# Altium schematic sheet SINUX_V3_MAIN.SchDoc
size 594 x 420 mm
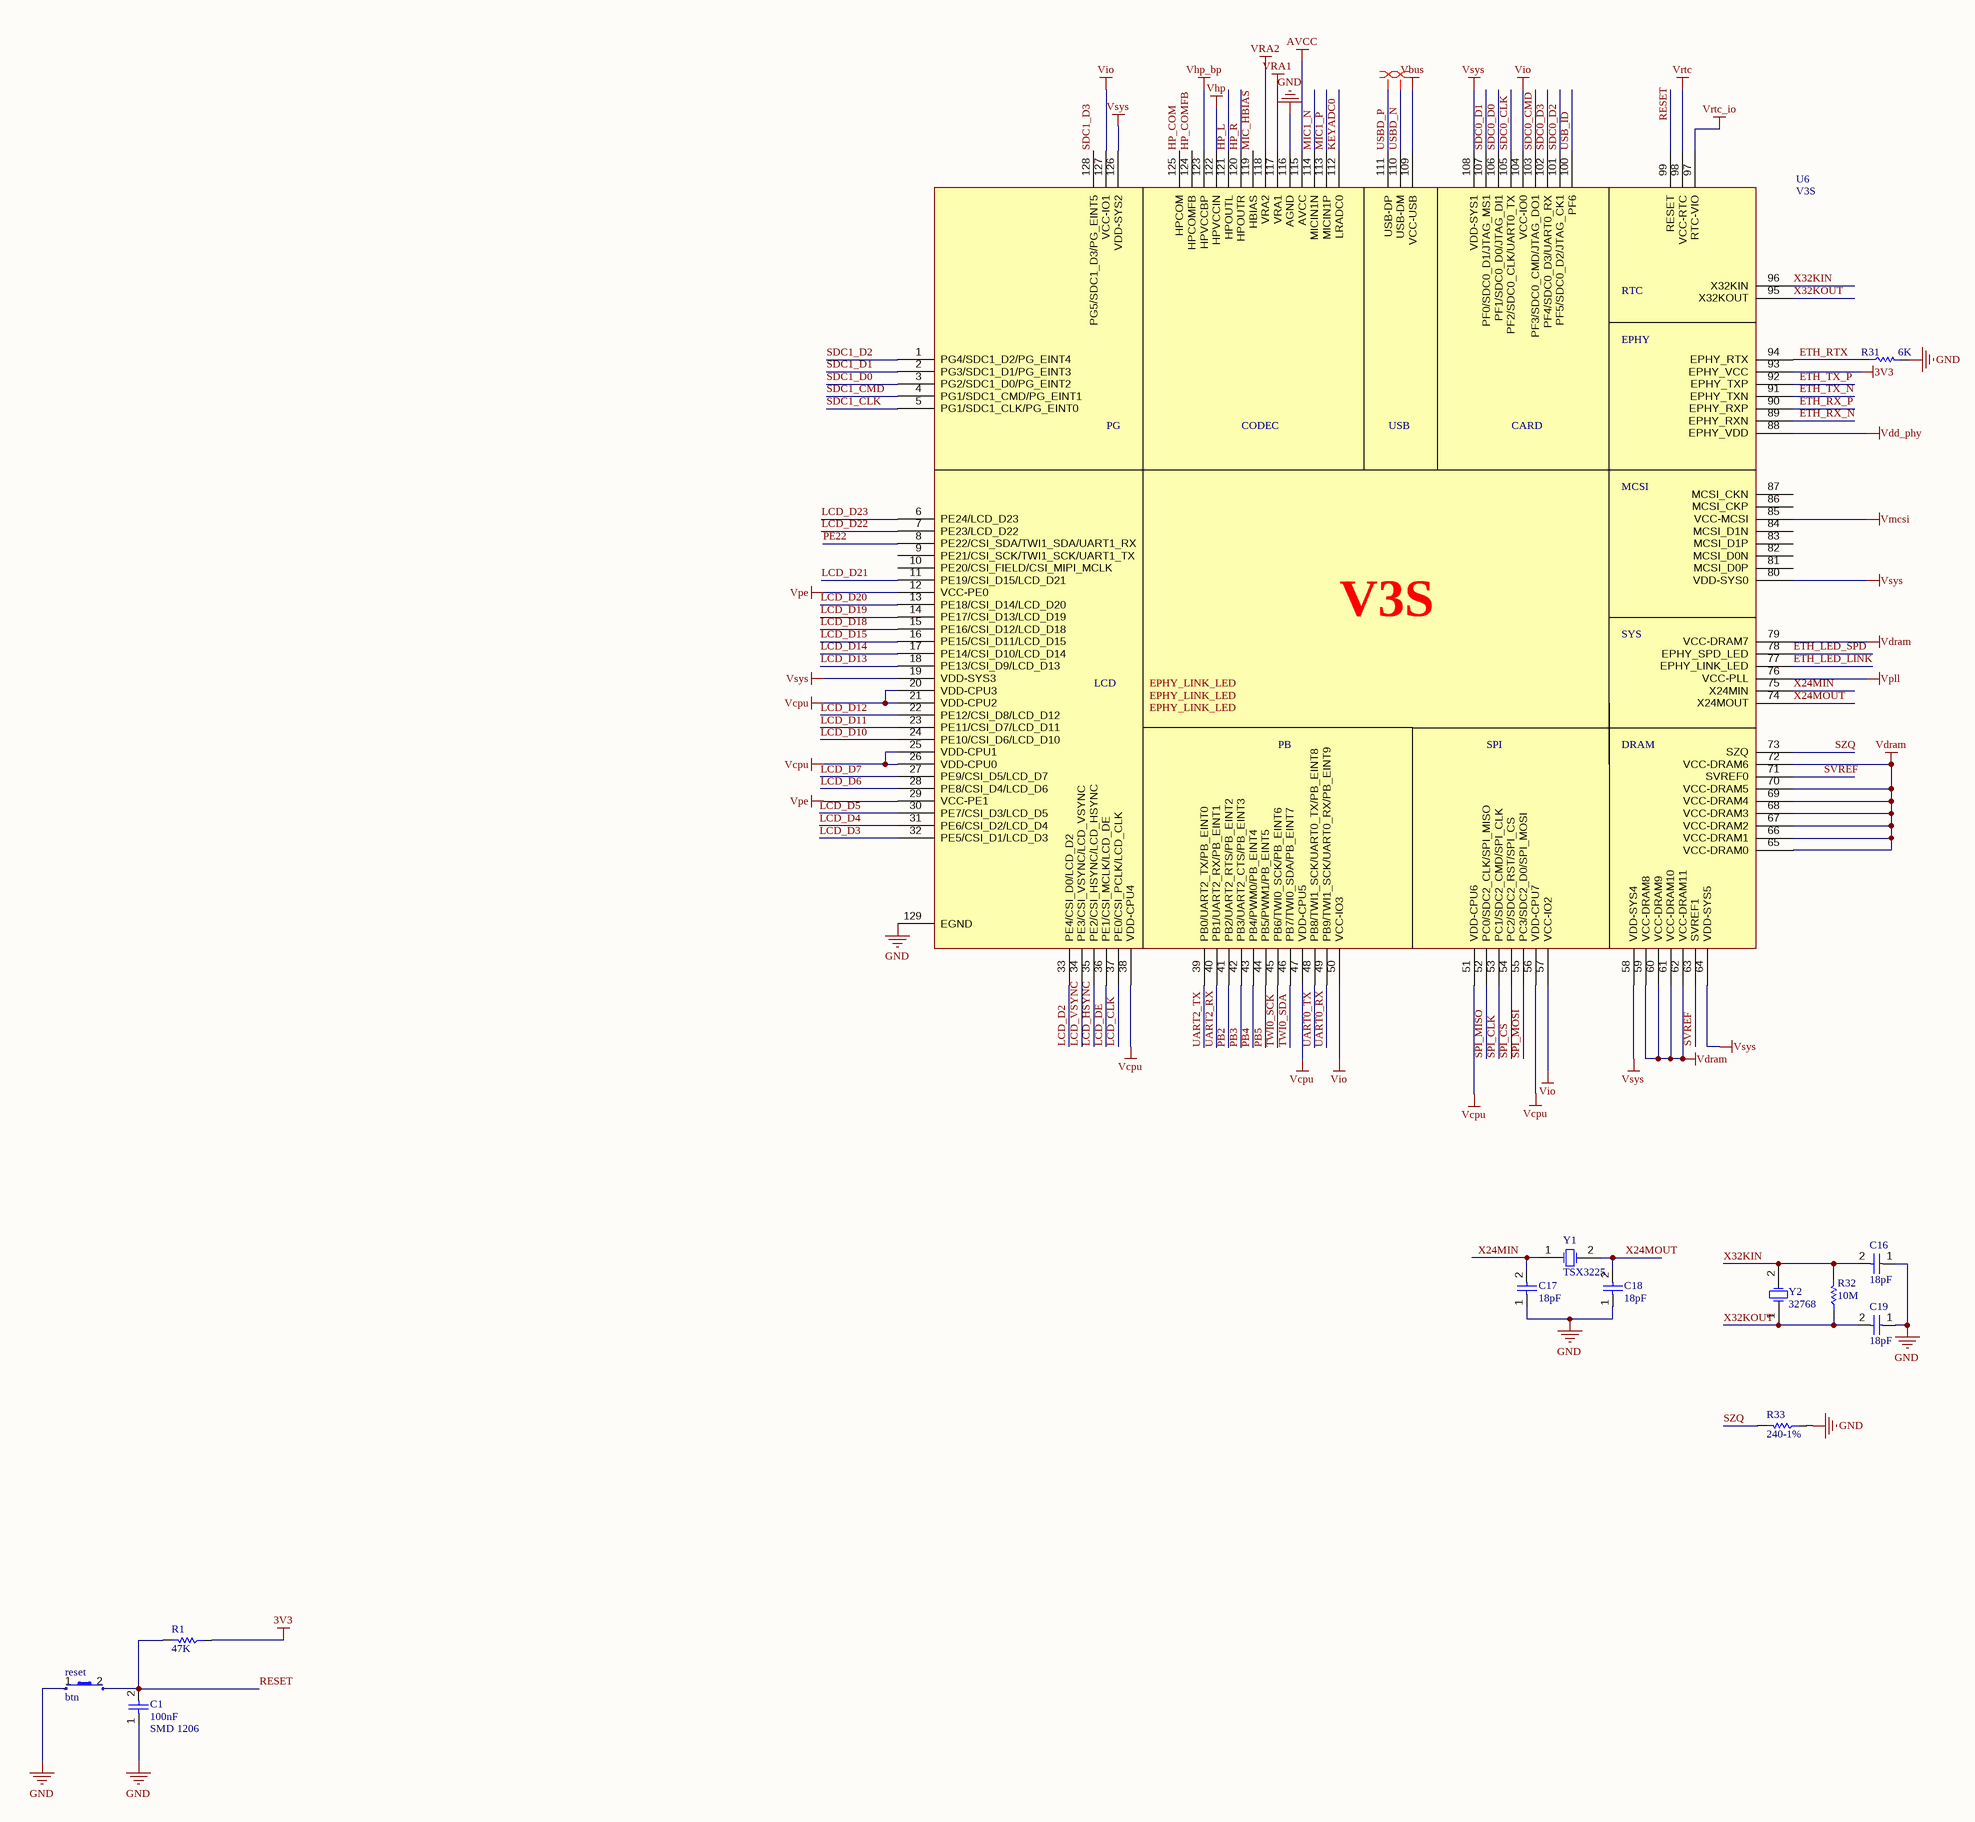
[diagram p0: SINUX_V3_MAIN.SchDoc]

## Parts
C1  100nF  [SMD 0805]
C16  18pF  [SMD 0805]
C17  18pF  [SMD 0805]
C18  18pF  [SMD 0805]
C19  18pF  [SMD 0805]
R1  47K  [0805_1/8W]
R31  6K  [0805_1/8W]
R32  10M  [0805_1/8W]
R33  240-1%  [0805_1/8W]
reset  btn  [btn]
U6  V3S  [V3S]
Y1  TSX3225  [XTAL  SMD]
Y2  32768  [XTAL RTC]

## Nets
3V3: R1.1 U6.93(EPHY_VCC)
AVCC: U6.115(AVCC)
GND: C1.1 C16.1 C17.1 C18.1 C19.1 R31.2 R33.1 reset.1 U6.116(AGND) U6.129(EGND)
Vbus: U6.109(VCC-USB)
Vcpu: U6.20(VDD-CPU3) U6.21(VDD-CPU2) U6.25(VDD-CPU1) U6.26(VDD-CPU0) U6.38(VDD-CPU4) U6.47(VDD-CPU5) U6.51(VDD-CPU6) U6.56(VDD-CPU7)
Vdd_phy: U6.88(EPHY_VDD)
Vdram: U6.59(VCC-DRAM8) U6.60(VCC-DRAM9) U6.61(VCC-DRAM10) U6.62(VCC-DRAM11) U6.65(VCC-DRAM0) U6.66(VCC-DRAM1) U6.67(VCC-DRAM2) U6.68(VCC-DRAM3) U6.69(VCC-DRAM4) U6.70(VCC-DRAM5) U6.72(VCC-DRAM6) U6.79(VCC-DRAM7)
Vhp: U6.122(HPVCCIN)
Vhp_bp: U6.123(HPVCCBP)
Vio: U6.50(VCC-IO3) U6.57(VCC-IO2) U6.104(VCC-IO0) U6.127(VCC-IO1)
Vmcsi: U6.85(VCC-MCSI)
Vpe: U6.12(VCC-PE0) U6.29(VCC-PE1)
Vpll: U6.76(VCC-PLL)
VRA1: U6.117(VRA1)
VRA2: U6.118(VRA2)
Vrtc: U6.98(VCC-RTC)
Vrtc_io: U6.97(RTC-VIO)
Vsys: U6.19(VDD-SYS3) U6.58(VDD-SYS4) U6.64(VDD-SYS5) U6.80(VDD-SYS0) U6.108(VDD-SYS1) U6.126(VDD-SYS2)
ETH_LED_LINK: U6.77(EPHY_LINK_LED)
ETH_LED_SPD: U6.78(EPHY_SPD_LED)
ETH_RTX: R31.1 U6.94(EPHY_RTX)
ETH_RX_N: U6.89(EPHY_RXN)
ETH_RX_P: U6.90(EPHY_RXP)
ETH_TX_N: U6.91(EPHY_TXN)
ETH_TX_P: U6.92(EPHY_TXP)
HP_COM: U6.125(HPCOM)
HP_COMFB: U6.124(HPCOMFB)
HP_L: U6.121(HPOUTL)
HP_R: U6.120(HPOUTR)
KEYADC0: U6.112(LRADC0)
LCD_CLK: U6.37(PE0/CSI_PCLK/LCD_CLK)
LCD_D2: U6.33(PE4/CSI_D0/LCD_D2)
LCD_D3: U6.32(PE5/CSI_D1/LCD_D3)
LCD_D4: U6.31(PE6/CSI_D2/LCD_D4)
LCD_D5: U6.30(PE7/CSI_D3/LCD_D5)
LCD_D6: U6.28(PE8/CSI_D4/LCD_D6)
LCD_D7: U6.27(PE9/CSI_D5/LCD_D7)
LCD_D10: U6.24(PE10/CSI_D6/LCD_D10)
LCD_D11: U6.23(PE11/CSI_D7/LCD_D11)
LCD_D12: U6.22(PE12/CSI_D8/LCD_D12)
LCD_D13: U6.18(PE13/CSI_D9/LCD_D13)
LCD_D14: U6.17(PE14/CSI_D10/LCD_D14)
LCD_D15: U6.16(PE15/CSI_D11/LCD_D15)
LCD_D18: U6.15(PE16/CSI_D12/LCD_D18)
LCD_D19: U6.14(PE17/CSI_D13/LCD_D19)
LCD_D20: U6.13(PE18/CSI_D14/LCD_D20)
LCD_D21: U6.11(PE19/CSI_D15/LCD_D21)
LCD_D22: U6.7(PE23/LCD_D22)
LCD_D23: U6.6(PE24/LCD_D23)
LCD_DE: U6.36(PE1/CSI_MCLK/LCD_DE)
LCD_HSYNC: U6.35(PE2/CSI_HSYNC/LCD_HSYNC)
LCD_VSYNC: U6.34(PE3/CSI_VSYNC/LCD_VSYNC)
MIC1_N: U6.114(MICIN1N)
MIC1_P: U6.113(MICIN1P)
MIC_HBIAS: U6.119(HBIAS)
PB2: U6.41(PB2/UART2_RTS/PB_EINT2)
PB3: U6.42(PB3/UART2_CTS/PB_EINT3)
PB4: U6.43(PB4/PWM0/PB_EINT4)
PB5: U6.44(PB5/PWM1/PB_EINT5)
PE22: U6.8(PE22/CSI_SDA/TWI1_SDA/UART1_RX)
RESET: C1.2 R1.2 reset.2 U6.99(RESET)
SDC0_CLK: U6.105(PF2/SDC0_CLK/UART0_TX)
SDC0_CMD: U6.103(PF3/SDC0_CMD/JTAG_DO1)
SDC0_D0: U6.106(PF1/SDC0_D0/JTAG_DI1)
SDC0_D1: U6.107(PF0/SDC0_D1/JTAG_MS1)
SDC0_D2: U6.101(PF5/SDC0_D2/JTAG_CK1)
SDC0_D3: U6.102(PF4/SDC0_D3/UART0_RX)
SDC1_CLK: U6.5(PG1/SDC1_CLK/PG_EINT0)
SDC1_CMD: U6.4(PG1/SDC1_CMD/PG_EINT1)
SDC1_D0: U6.3(PG2/SDC1_D0/PG_EINT2)
SDC1_D1: U6.2(PG3/SDC1_D1/PG_EINT3)
SDC1_D2: U6.1(PG4/SDC1_D2/PG_EINT4)
SDC1_D3: U6.128(PG5/SDC1_D3/PG_EINT5)
SPI_CLK: U6.53(PC1/SDC2_CMD/SPI_CLK)
SPI_CS: U6.54(PC2/SDC2_RST/SPI_CS)
SPI_MISO: U6.52(PC0/SDC2_CLK/SPI_MISO)
SPI_MOSI: U6.55(PC3/SDC2_D0/SPI_MOSI)
SVREF: U6.63(SVREF1) U6.71(SVREF0)
SZQ: R33.2 U6.73(SZQ)
TWI0_SCK: U6.45(PB6/TWI0_SCK/PB_EINT6)
TWI0_SDA: U6.46(PB7/TWI0_SDA/PB_EINT7)
UART0_RX: U6.49(PB9/TWI1_SCK/UART0_RX/PB_EINT9)
UART0_TX: U6.48(PB8/TWI1_SCK/UART0_TX/PB_EINT8)
UART2_RX: U6.40(PB1/UART2_RX/PB_EINT1)
UART2_TX: U6.39(PB0/UART2_TX/PB_EINT0)
USB_ID: U6.100(PF6)
USBD_N: U6.110(USB-DM)
USBD_P: U6.111(USB-DP)
X24MIN: C17.2 U6.75(X24MIN) Y1.1(OSC1)
X24MOUT: C18.2 U6.74(X24MOUT) Y1.2(OSC2)
X32KIN: C16.2 R32.2 U6.96(X32KIN) Y2.2(OSC2)
X32KOUT: C19.2 R32.1 U6.95(X32KOUT) Y2.1(OSC1)

Not connected (* = marked no-connect by the designer): U6 9(PE21/CSI_SCK/TWI1_SCK/UART1_TX) 10(PE20/CSI_FIELD/CSI_MIPI_MCLK) 81(MCSI_D0P) 82(MCSI_D0N) 83(MCSI_D1P) 84(MCSI_D1N) 86(MCSI_CKP) 87(MCSI_CKN)

## Layout directives
differential pair: USBD_N, USBD_P

## Notes on the sheet
- Labels drawn without touching a wire or pin: EPHY_LINK_LED
- DWG NO:
- REV:
- THIS DOCUMENT AND THE DATA DISCLOSED HEREIN OR
- HEREWITH IS THE PROPERTY OF ALTIUM LIMITED AND MAY
- BE FREELY DISTRIBUTED IN WHOLE. NO RIGHTS ARE
- RESERVED OR EXPRESS OR IMPLIED WARANTEE GIVEN.
- REVISION
- DESCRIPTION
- DATE
- APPROVED
- ENG:
- APPROVALS
- PROJECT
- DSN:
- CHK:
- REFERENCE DOCUMENTS
- PROJECT REVISION:
- TITLE
- DOCUMENT REVISION:
- DESIGN ITEM:
- BOM:
- FAB DWG:
- PCB DWG:
- ASSY DWG:
- SCALE:
- A2
- SIZE
- CAGE CODE
- FILE NAME
- DWG NO.
- SHEET
- OF
- REV
- (in symbol CAP NON) SMD 1206
- (in symbol V3S) RTC; EPHY; PG; CODEC; USB; CARD; MCSI; SYS; LCD; PB; SPI; DRAM

## Library data of the parts
C1 C16-C19 = CAP NON
R1 R31-R33 = RESISTOR
Y1 Y2 = XTAL